# Altium schematic sheet Interface.SchDoc
size 127 x 127 mm; SheetNumber: 5; SheetTotal: 5
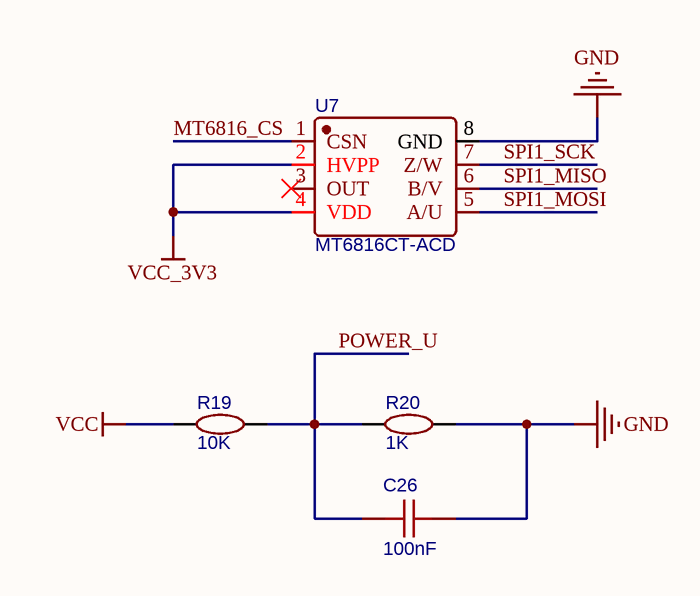
[diagram p0: Interface.SchDoc]

## Parts
C26  100nF  [C0603]
R19  10K  [R0603]
R20  1K  [R0603]
U7  MT6816CT-ACD  [SOP-8_L5.0-W4.0-P1.27-LS6.0-BL]

## Nets
GND: C26.2 R20.2 U7.8(GND)
VCC: R19.1
VCC_3V3: U7.2(HVPP) U7.4(VDD)
MT6816_CS: U7.1(CSN)
POWER_U: C26.1 R19.2 R20.1
SPI1_MISO: U7.6(B/V)
SPI1_MOSI: U7.5(A/U)
SPI1_SCK: U7.7(Z/W)

Not connected (* = marked no-connect by the designer): U7 3(OUT)*

## Library data of the parts
C26 = 100nF: BOM_Manufacturer: SAMSUNG; BOM_Manufacturer Part: CL10B104KB8NNNC; nameAlias: Capacitance; BOM_Supplier: LCSC; BOM_Supplier Part: C1591; BOM_JLCPCB Part Class: Extended Part; spicePre: C; spiceSymbolName: CL10B104KB8NNNC
R19 = 10K: BOM_Manufacturer: UniOhm; BOM_Manufacturer Part: 0603WAF1002T5E; nameAlias: Resistance (Ohms); BOM_Supplier: LCSC; BOM_Supplier Part: C25804; BOM_JLCPCB Part Class: Basic Part; spicePre: R; spiceSymbolName: 0603WAF1002T5E
R20 = 1K: BOM_Manufacturer: UniOhm; BOM_Manufacturer Part: 0603WAF1001T5E; nameAlias: Resistance (Ohms); BOM_Supplier: LCSC; BOM_Supplier Part: C21190; BOM_JLCPCB Part Class: Basic Part; spicePre: R; spiceSymbolName: 0603WAF1001T5E
U7 = MT6816CT-ACD: BOM_Manufacturer: Magn Tek; Contributor: LCSC; BOM_Supplier: LCSC; BOM_Supplier Part: C879560; BOM_Manufacturer Part: MT6816CT-ACD; BOM_JLCPCB Part Class: Extended Part; spicePre: U; spiceSymbolName: MT6816CT-ACD